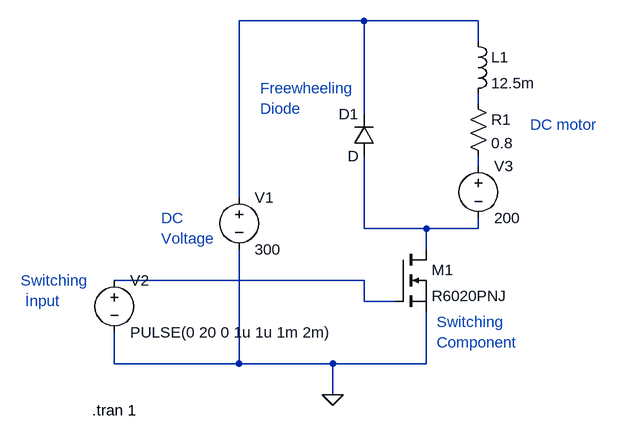
[diagram p0: schematic Draft1.asc]
Draft1.asc, the LTspice schematic file:
Version 4
SHEET 1 880 680
WIRE 288 -160 96 -160
WIRE 464 -160 288 -160
WIRE 464 -128 464 -160
WIRE 464 -32 464 -48
WIRE 288 -16 288 -160
WIRE 464 64 464 48
WIRE 96 112 96 -160
WIRE 288 160 288 48
WIRE 384 160 288 160
WIRE 464 160 464 144
WIRE 464 160 384 160
WIRE 384 192 384 160
WIRE 288 240 -96 240
WIRE 288 272 288 240
WIRE 336 272 288 272
WIRE -96 368 -96 320
WIRE 96 368 96 192
WIRE 96 368 -96 368
WIRE 240 368 96 368
WIRE 384 368 384 288
WIRE 384 368 240 368
WIRE 240 416 240 368
FLAG 240 416 0
SYMBOL voltage 96 96 R0
WINDOW 123 0 0 Left 0
WINDOW 39 0 0 Left 0
SYMATTR InstName V1
SYMATTR Value 300
SYMBOL ind 448 -144 R0
SYMATTR InstName L1
SYMATTR Value 12.5m
SYMBOL res 448 -48 R0
SYMATTR InstName R1
SYMATTR Value 0.8
SYMBOL voltage -96 224 R0
WINDOW 123 0 0 Left 0
WINDOW 39 0 0 Left 0
SYMATTR InstName V2
SYMATTR Value PULSE(0 20 0 1u 1u 1m 2m)
SYMBOL diode 304 48 R180
WINDOW 0 24 64 Left 2
WINDOW 3 24 0 Left 2
SYMATTR InstName D1
SYMBOL nmos 336 192 R0
SYMATTR InstName M1
SYMATTR Value R6020PNJ
SYMBOL voltage 464 48 R0
WINDOW 123 0 0 Left 0
WINDOW 39 0 0 Left 0
SYMATTR InstName V3
SYMATTR Value 200
TEXT -130 440 Left 2 !.tran 1
TEXT 544 0 Left 2 ;DC motor
TEXT 128 -56 Left 2 ;Freewheeling \nDiode
TEXT -24 144 Left 2 ;DC \nVoltage
TEXT -240 240 Left 2 ;Switching\n İnput
TEXT 400 304 Left 2 ;Switching \nComponent

The netlist it stands for:
* Draft1.asc
V1 N001 0 300
L1 N001 N002 12.5m
R1 N002 N003 0.8
V2 N005 0 PULSE(0 20 0 1u 1u 1m 2m)
D1 N004 N001 D
M1 N004 N005 0 0 R6020PNJ
V3 N003 N004 200
.model D D
.lib standard.dio
.model NMOS NMOS
.model PMOS PMOS
.lib standard.mos
.tran 1
* DC motor
* Freewheeling
* Diode
* DC
* Voltage
* Switching
*  İnput
* Switching
* Component
.backanno
.end